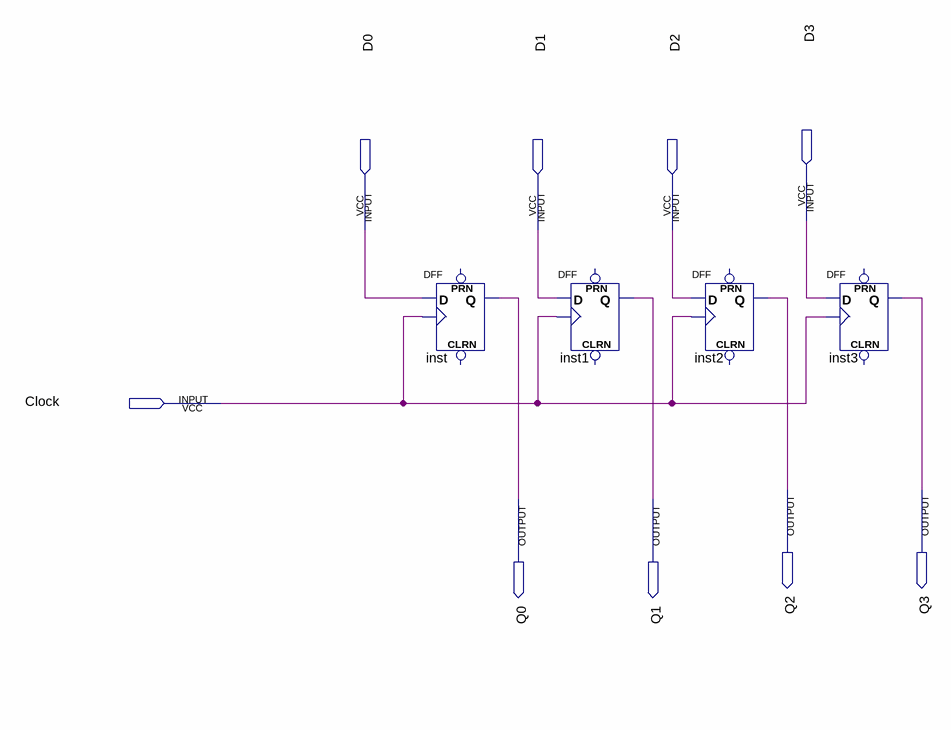
[diagram p0: schematic sheet]
// Quartus schematic 4bit_pr_reg.bdf as structural Verilog: 4 symbols, 9 pins
module \4bit_pr_reg  (
  input  D3,
  input  D0,
  input  D1,
  input  D2,
  input  Clock,
  output Q2,
  output Q3,
  output Q0,
  output Q1
);

  DFF inst (.CLK(Clock), .D(D0), .Q(Q0));  // open: CLRN, PRN
  DFF inst1 (.CLK(Clock), .D(D1), .Q(Q1));  // open: CLRN, PRN
  DFF inst2 (.CLK(Clock), .D(D2), .Q(Q2));  // open: CLRN, PRN
  DFF inst3 (.CLK(Clock), .D(D3), .Q(Q3));  // open: CLRN, PRN
endmodule
